# Altium project ECGAquisitionBoard.PrjPcb
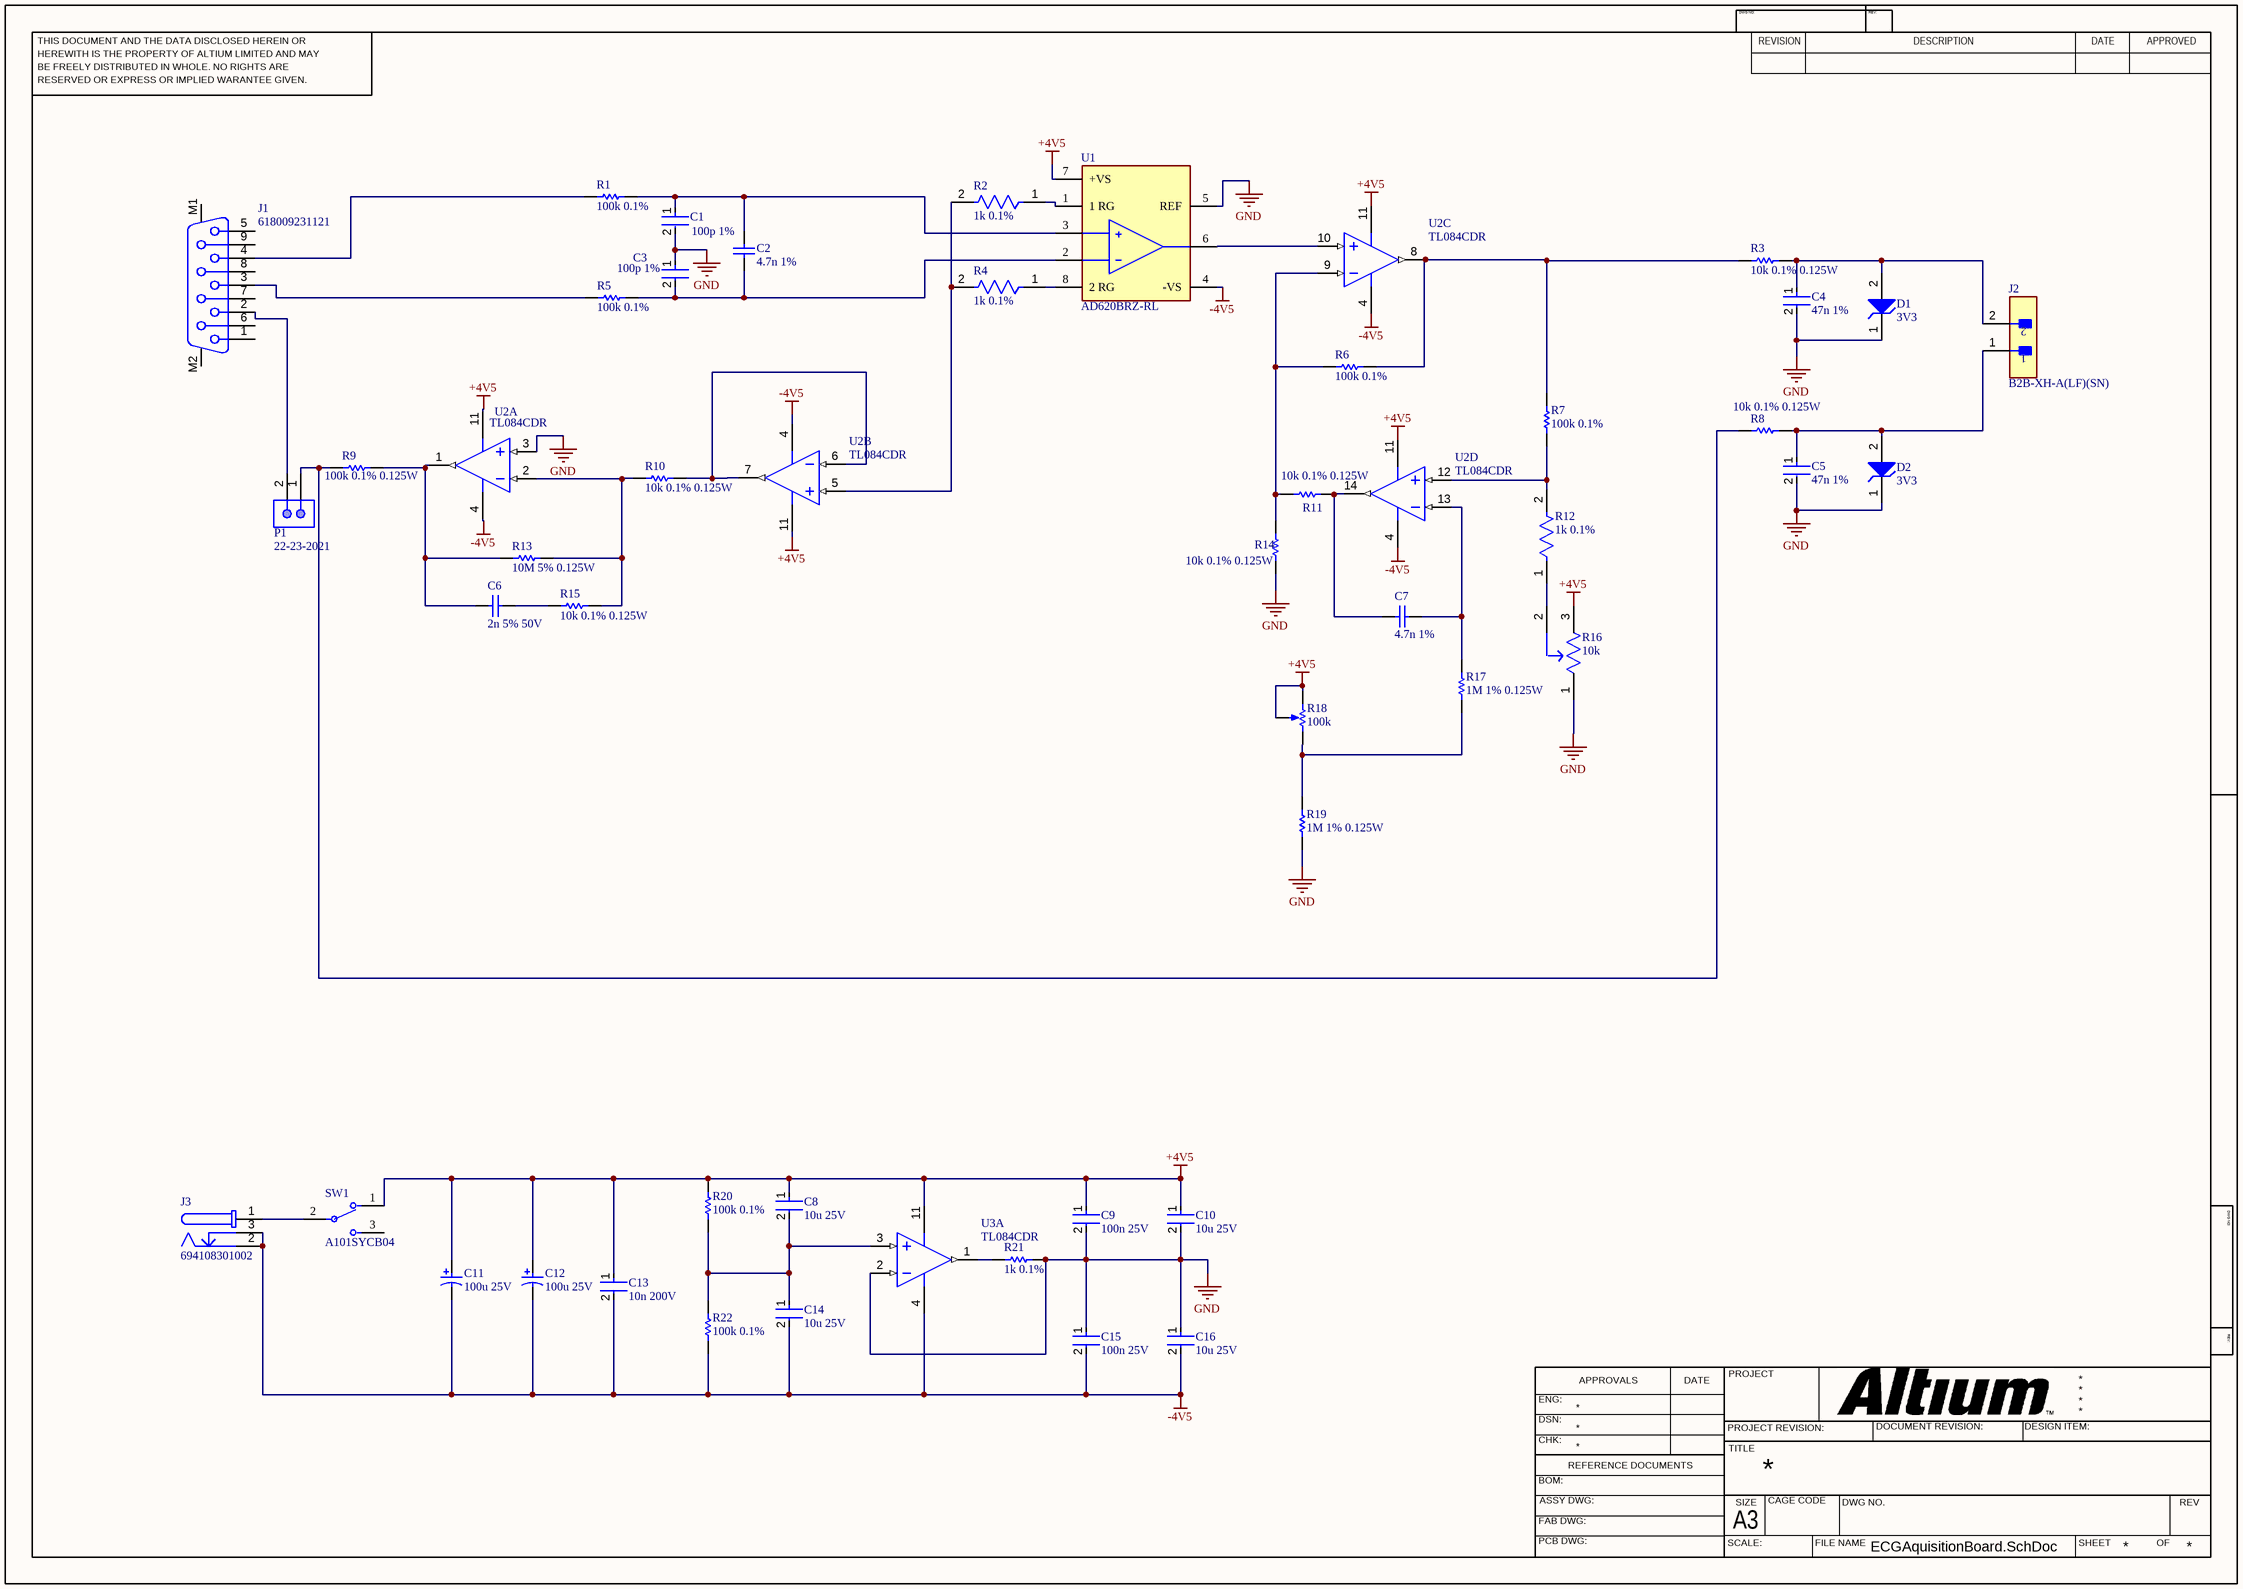
[diagram p0: ECGAquisitionBoard.SchDoc]
1 sheet, 48 parts. Net scope: global (net labels, ports and power ports of the same name join across sheets).
Board file: ECGAquisitionBoard.PcbDoc

## Sheet ECGAquisitionBoard.SchDoc
size 420 x 297 mm

### Parts
C1  100p 1%  [FP-0805-L_2_01_0_2-W_1_25-IPC_B]
C2  4.7n 1%  [CAPC2013X94X50ML20T25]
C3  100p 1%  [FP-0805-L_2_01_0_2-W_1_25-IPC_B]
C4  47n 1%  [FP-C1206C-EB-MFG]
C5  47n 1%  [FP-C1206C-EB-MFG]
C6  2n 5% 50V  [CAPC2013X70X45NL10T25]
C7  4.7n 1%  [CAPC2013X94X50ML20T25]
C8  10u 25V  [FP-GRM21B-0_15-IPC_C]
C9  100n 25V  [FP-C0805C-DN-MFG]
C10  10u 25V  [FP-GRM21B-0_15-IPC_C]
C11  100u 25V  [PNSC-FK-V-D8_V]
C12  100u 25V  [PNSC-FK-V-D8_V]
C13  10n 200V  [FP-0805-L_2_01_0_2-W_1_25-IPC_A]
C14  10u 25V  [FP-GRM21B-0_15-IPC_C]
C15  100n 25V  [FP-C0805C-DN-MFG]
C16  10u 25V  [FP-GRM21B-0_15-IPC_C]
D1  3V3  [ONSC-SOD-123-2-425-04_V]
D2  3V3  [ONSC-SOD-123-2-425-04_V]
J1  618009231121  [618009231121]
J2  B2B-XH-A(LF)(SN)  [FP-B2B-XH-A_LF_SN-MFG]
J3  694108301002  [694108301002]
P1  22-23-2021  [MOLX-22-23-2021_V]
R1  100k 0.1%  [RESC2013X60X40LL20T25_A]
R2  1k 0.1%  [FP-ERA6A-IPC_C]
R3  10k 0.1% 0.125W  [RESC2013X60X40LL20T25_A]
R4  1k 0.1%  [FP-ERA6A-IPC_C]
R5  100k 0.1%  [RESC2013X60X40LL20T25_A]
R6  100k 0.1%  [RESC2013X60X40LL20T25_A]
R7  100k 0.1%  [RESC2013X60X40LL20T25_A]
R8  10k 0.1% 0.125W  [RESC2013X60X40LL20T25_A]
R9  100k 0.1% 0.125W  [RESC2013X60X40LL20T25_A]
R10  10k 0.1% 0.125W  [RESC2013X60X40LL20T25_A]
R11  10k 0.1% 0.125W  [RESC2013X60X40LL20T25_A]
R12  1k 0.1%  [FP-ERA6A-IPC_C]
R13  10M 5% 0.125W  [RESC2013X50X30LL20T20]
R14  10k 0.1% 0.125W  [RESC2013X60X40LL20T25_A]
R15  10k 0.1% 0.125W  [RESC2013X60X40LL20T25_A]
R16  10k  [FP-3266W-MFG]
R17  1M 1% 0.125W  [RESC3216X70X50NL05T20]
R18  100k  [BOUR-3266W-3_V]
R19  1M 1% 0.125W  [RESC3216X70X50NL05T20]
R20  100k 0.1%  [RESC2013X60X40LL20T25_A]
R21  1k 0.1%  [RESC2013X60X40LL20T25_A]
R22  100k 0.1%  [RESC2013X60X40LL20T25_A]
SW1  A101SYCB04  [FP-A101SYCB04-MFG]
U1  AD620BRZ-RL  [FP-R-8-IPC_A]
U2  TL084CDR  [D0014A_N]  (parts A,B,C,D of 4)
U3  TL084CDR  [D0014A_N]  (part A of 4)

### Nets
+4V5: C8.1 C9.1 C10.1 C11.1 C12.1 C13.1 R16.3(CW) R18.1(CCW) R18.2(WIPER) R20.2 SW1.1 U1.7(+VS) U2.11(VCC-) U3.11(VCC-)
-4V5: C11.2 C12.2 C13.2 C14.2 C15.2 C16.2 J3.2 J3.3 R22.1 U1.4(-VS) U2.4(VCC+) U3.4(VCC+)
GND: C1.2 C3.1 C4.2 C5.2 C9.2 C10.2 C15.1 C16.1 D1.1(K) D2.1(K) R14.1 R16.1(CCW) R19.1 R21.1 U1.5(REF) U2.3(IN1+) U3.2(IN1-)
NetC1_1: C1.1 C2.2 R1.1 U1.3(+IN)
NetC2_1: C2.1 C3.2 R5.1 U1.2(-IN)
NetC4_1: C4.1 D1.2(A) J2.2 R3.1
NetC5_1: C5.1 D2.2(A) J2.1 R8.1
NetC6_1: C6.1 R9.1 R13.1 U2.1(OUT1)
NetC6_2: C6.2 R15.2
NetC7_1: C7.1 R17.2 U2.13(IN4-)
NetC7_2: C7.2 R11.1 U2.14(OUT4)
NetC8_2: C8.2 C14.1 R20.1 R22.2 U3.3(IN1+)
NetJ1_2: J1.2 P1.2
NetJ1_3: J1.3 R5.2
NetJ1_4: J1.4 R1.2
NetJ3_1: J3.1 SW1.2
NetP1_1: P1.1 R8.2 R9.2
NetR2_1: R2.1 U1.1(1_RG)
NetR2_2: R2.2 R4.2 U2.5(IN2+)
NetR3_2: R3.2 R6.1 R7.1 U2.8(OUT3)
NetR4_1: R4.1 U1.8(2_RG)
NetR6_2: R6.2 R11.2 R14.2 U2.9(IN3-)
NetR7_2: R7.2 R12.2 U2.12(IN4+)
NetR10_1: R10.1 U2.6(IN2-) U2.7(OUT2)
NetR10_2: R10.2 R13.2 R15.1 U2.2(IN1-)
NetR12_1: R12.1 R16.2(WIPER)
NetR17_1: R17.1 R18.3(CW) R19.2
NetR21_2: R21.2 U3.1(OUT1)
NetU1_6: U1.6(OUTPUT) U2.10(IN3+)

Not connected (* = marked no-connect by the designer): J1 1 5 6 7 8 9 M1 M2; SW1 3

### Notes on the sheet
- THIS DOCUMENT AND THE DATA DISCLOSED HEREIN OR
- HEREWITH IS THE PROPERTY OF ALTIUM LIMITED AND MAY
- DWG NO:
- REVISION
- REV:
- DESCRIPTION
- DATE
- APPROVED
- BE FREELY DISTRIBUTED IN WHOLE. NO RIGHTS ARE
- RESERVED OR EXPRESS OR IMPLIED WARANTEE GIVEN.
- ENG:
- APPROVALS
- PROJECT
- DSN:
- CHK:
- REFERENCE DOCUMENTS
- PROJECT REVISION:
- TITLE
- DOCUMENT REVISION:
- DESIGN ITEM:
- BOM:
- FAB DWG:
- PCB DWG:
- ASSY DWG:
- SCALE:
- A3
- SIZE
- CAGE CODE
- FILE NAME
- DWG NO.
- SHEET
- OF
- REV

### Library data of the parts
C1 C3 = CMP-2007-04119-2: General Purpose Ceramic Capacitor, 0805, 100pF, 1%, C0G, 30ppm/°C, 100V; Max Operating Temperature: 125°C; Lead Free: Lead Free; Tolerance: 1%; Case Code (Imperial): 0805; Dielectric: C0G; RoHS Compliant: Yes; Termination: SMD/SMT; Packaging: Tape and Reel; Depth: 1.25mm; Dielectric Material: Ceramic; REACH SVHC: No SVHC; Thickness: 0.037inch; Case Code (Metric): 2012; Series: -; Mount: Surface Mount; Min Operating Temperature: -55°C; Voltage: 100V; Capacitance: 100pF; Length: 2.01mm; Number of Pins: 2; Radiation Hardening: No; Voltage Rating: 100V; Voltage Rating (DC): 100V; Height: 0.71mm; Width: 1.25mm; Case/Package: 0805; Construction: Flat; Package Quantity: 1
C2 C7 = CMP-1036-03569-3: Part Number: 08053A472FAT2A; Manufacturer: AVX Interconnect / Elco
C4 C5 = CMP-1037-03977-2: CAP CER 0.047UF 50V NP0 1206; Manufacturer: KEMET; Manufacturer Part Number: C1206C473F5GACTU; Description: C1206 47,000 pF C0G 1.00% 50 V; Tolerance: 0.01; Automotive Grade: Grade 0; Value: 47,000 pF; Material: Ceramic; Temperature Coefficient: 15%; Temperature Characteristic: C0G; Device Class L1: Passive Components; Lead Free: Yes; Voltage Rating: 50 V; ComponentLink2URL: https://content.kemet.com/datasheets/KEM_C1007_X8R_ULTRA_150C_SMD.pdf; Device Class L2: Capacitors; Capacitance: 47,000 pF; Temperature Range High: +150°C; RoHS: TRUE; Temperature Range Low: -55°C; Category: Cap; Mouser Description: Multilayer Ceramic Capacitors MLCC - SMD/SMT 50volts 0.047uF 1% C0G; Height: 0.88mm; Device Class L3: Ceramic Capacitors; ComponentLink2Description: Datasheet; Octopart: https://octopart.com/c1206c473f5gactu-kemet-13140371; Digikey Description: CAP CER 0.047UF 50V NP0 1206; Package: C1206C-EB; Automotive: Yes; Temperature: -55°C to +150°C; Ipc Land Pattern Name: CAPC320160X78
C6 = CMP-2007-00880-1: Part Number: GRM2165C1H202JA01D; Manufacturer: Murata
C8 C10 C14 C16 = CMP-2007-03541-2: Chip Multilayer Ceramic Capacitors for General Purpose, 0805, 10uF, X5R, 15%, 10%, 25V; Length: 2mm; Depth: 1.25mm; Termination: SMD/SMT; Voltage: 25V; Height: 1.25mm; Material: Ceramic; Thickness: 0.053inch; Radiation Hardening: No; Min Operating Temperature: -55°C; Width: 0.049inch; Package Quantity: 1; Mount: Surface Mount; Dielectric: X5R; Packaging: Tape and Reel; Capacitance: 10uF; Voltage Rating (DC): 25V; Lead Free: Lead Free; Max Operating Temperature: 85°C; Case Code (Imperial): 0805; Case/Package: 0805; Tolerance: 10%; Voltage Rating: 25V; Case Code (Metric): 2012
C9 C15 = CMP-2007-00282-2: CAP CER 0.1UF 25V 20% X7R 0805; Manufacturer: KEMET; Manufacturer Part Number: C0805C104M3RACTU; Temperature Coefficient: 30ppm/°C; Capacitance: 0.10 μF; Description: C0805 0.10 μF X7R 30ppm/°C 20.00% 25 V; Material: Ceramic; Tolerance: 0.2; Value: 0.10 μF; Digikey Description: CAP CER 0.1UF 25V 20% X7R 0805; Device Class L2: Capacitors; Temperature: -55°C to +125°C; Device Class L1: Passive Components; ComponentLink2Description: Datasheet; Mouser Description: Multilayer Ceramic Capacitors MLCC - SMD/SMT 25volts 0.1uF X7R 20%; Temperature Range High: +125°C; Device Class L3: Ceramic Capacitors; Package: C0805C-DN; Automotive: No; Temperature Range Low: -55°C; RoHS: TRUE; Category: Cap; Lead Free: Yes; Ipc Land Pattern Name: CAPC200125X78; Voltage Rating: 25 V; Height: 0.88mm; Temperature Characteristic: X7R; Octopart: https://octopart.com/c0805c104m3ractu-kemet-9138612; ComponentLink2URL: https://content.kemet.com/datasheets/KEM_C1003_C0G_SMD.pdf
C11 C12 = CMP-2000-06206-1: Aluminum Electrolytic Capacitor, 100 uF, +/- 20%, 25 V, 2-Pin SMD (Size Code D8), -55 to 105 degC, RoHS, Tape and Reel; Manufacturer: Panasonic; Type: Can; Lifetime@Temperature: 2000Hrs@105°C; Capacitance: 100µF; Ripple Current: 280mA; Impedance: 0.34O; Case Size/Dimension: Ø6.3x7.7mm; Operating Temp-Max: 105°C; Series: FK; Package URL: http://industrial.panasonic.com/cdbs/www-data/pdf/RDE0000/DME0000COL48.pdf; Mounting Technology: SurfaceMount; Package Description: 2-Pin Electrolytic Aluminum Capacitor, Body 6.6 x 6.6 mm; Datasheet Version: 03/2016; Datasheet URL: http://industrial.panasonic.com/cdbs/www-data/pdf/RDE0000/ABA0000C1181.pdf; Manufacturer URL: http://www.panasonic.com/; Package Reference: FK-V-D8; Rated Voltage: 25V; Operating Temp Range: -55to+105°C
C13 = CMP-2007-04596-2: General Purpose Ceramic Capacitor, 0805, 10nF, 10%, X7R, 0.15, 200V; Dissipation Factor: 2.5%; Package Quantity: 1; Case/Package: 0805; Case Code (Metric): 2012; Voltage Rating: 200V; Voltage: 200V; Number of Pins: 2; Depth: 1.25mm; Length: 2.01mm; Dielectric: X7R; Lead Free: Lead Free; Mount: Surface Mount; REACH SVHC: No SVHC; Packaging: Tape and Reel; Termination: SMD/SMT; Radiation Hardening: No; Thickness: 0.037inch; Tolerance: 10%; Min Operating Temperature: -55°C; RoHS Compliant: Yes; Dielectric Material: Ceramic; Voltage Rating (DC): 200V; Contact Plating: Tin; Height: 0.94mm; Width: 0.049inch; Lead Pitch: 5.08mm; Case Code (Imperial): 0805; Capacitance: 10nF; Max Operating Temperature: 125°C
D1 D2 = CMP-1060-00363-1: Zener Voltage Regulator, 500 mW, 2-Pin SOD-123, Pb-Free, Tape and Reel; PartNumber: MMSZ5226BT1G; Manufacturer: On Semiconductor; P Max (W): 0.5; VZ Typ (V): 3.3; ComponentLink1Description: Manufacturer URL; ComponentLink3URL: http://www.onsemi.com/pub_link/Collateral/425-04.PDF; ComponentLink3Description: Package Specification; ComponentLink2Description: Datasheet; ComponentLink1URL: http://www.onsemi.com/; Mounting Technology: Surface Mount; Packing: Tape and Reel; PackageDescription: 2-Pin SOD, Body 1.6 x 2.69 mm; ComponentLink2URL: http://www.onsemi.com/pub_link/Collateral/MMSZ5221BT1-D.PDF; RoHS: Pb-Free; PackageVersion: Rev. G, 10/2009; PackageReference: SOD-123-2-425-04; DatasheetVersion: Rev. 12
J1 = CMP-1502-00200-2: NexarPartId: 18818187; Insulation Resistance: 5GΩ; Current Rating: 3A; Number of Contacts: 9; Contact Resistance: 30mΩ; Operating Supply Voltage: 125V; Gender: Female; Pitch: 2.77mm; Length: 30.8mm; Contact Material: Gold, Nickel; Insulation Material: PBT; RoHS: Compliant; Width: 12.5mm; Termination: SMD/SMT; Height: 12.7mm; Housing Material: Steel; Number of Pins: 9; Max Operating Temperature: 105°C; Mount: Through Hole; Contact Plating: Gold; Depth: 18.5mm; Min Operating Temperature: -55°C; REACH SVHC: Unknown; Number of Rows: 2; Orientation: Right Angle; Voltage Rating: 125V
J2 = CMP-2000-05888-3: CONN HEADER VERT 2POS 2.5MM; Current Rating: 3A; Voltage Rating: 250V; Number of Contacts: 2; Contact Resistance: 20mR; Wire/Cable Gauge: 22AWG; Insulation Resistance: 1GR; Connector Type: Male Pin; Packaging: Bulk; Contact Material: Brass; Lead Free: Lead Free; Orientation: Straight; Contact Plating: Tin; Max Current Rating: 3A; Termination: Solder; Fastening Type: Detent; Depth: 5.75mm; Housing Material: Polyamide; REACH SVHC: No SVHC; Series: XH; Voltage Rating (AC): 250V; Number of Positions: 2; Color: Natural; Contact Type: Male Pin; Max Voltage Rating (DC): 250V; Pitch: 2.5mm; Lead Pitch: 2.5mm; Mount: Through Hole; Max Operating Temperature: 85°C; Length: 7.4mm; Max Voltage Rating (AC): 250V; Min Operating Temperature: -25°C; Number of Rows: 1; Housing Color: White
J3 = CMP-1502-00190-3: NexarPartId: 52676102; Gender: Male; Voltage Rating: 24V; Insulation Resistance: 100MΩ; Voltage Rating (DC): 20V; Shielding: Unshielded; Connector Type: Power; Current Rating: 5A; Number of Contacts: 3; Packaging: Bulk; Operating Supply Voltage: 24V; Flammability Rating: UL94 V-0; Housing Material: Polyamide; Color: Black; REACH SVHC: Unknown; Contact Material: Gold, Tin; Max Operating Temperature: 85°C; Contact Gender: Female; Contact Plating: Tin; Termination: Through Hole; Min Operating Temperature: -40°C; RoHS: Compliant; Height: 11mm; Mount: Through Hole
P1 = CMP-1704-00001-3: Male Header, Pitch 2.54 mm, 1 x 2 Position, Height 10.67 mm, Tail Length 3.56 mm, 0 to 75 degC, RoHS, Bulk; Package Quantity: 3000; Height: 10.67 mm; RoHSCompliant: True; ComponentLink2URL: https://datasheet.ciiva.com/19454/232266-19454304.pdf; PartNumber: 22-23-2021; Packaging: Bulk; ComponentLink2Description: Datasheet; Min Operating Temperature: 0 degC; ComponentLink1Description: Manufacturer URL; Length: 5.08 mm; Mounting Technology: Through Hole; Max Operating Temperature: 75 degC; REACH SVHC: Unknown; PackageDescription: Male Header, Pitch 2.54 mm, 1 x 2 Position, Height 10.67 mm, Tail Length 3.56 mm; ComponentLink1URL: http://www.molex.com/; Mount: Through Hole; Radiation Hardening: No; Width: 6.35 mm; Pins: 2
R1 R3 R5-R11 R14 R15 R20-R22 = CMP-2001-00582-2: Metal Film Chip Resistor, High Reliability Type, 0.125 W, +/- 0.1%, -55 to 155 degC, 0805 (2012 Metric), RoHS, Tape and Reel; Voltage Rating: 100V; Power Rating: 125mW(1/8W); Brand: Panasonic; Temperature Coefficient: 25PPM/C; Resistance: 10kOhms; Product Category: ThinFilmResistors-SMD; Datasheet Version: 02/2016; Operating Temperature Range: -55Cto+155C; Length: 2mm; Mounting Technology: SurfaceMount; Manufacturer URL: http://www.panasonic.com/; Width: 1.25mm; Packaging: Reel; Product: ThinFilmResistorsSMD; Package / Case: 0805(2012metric); Termination Style: SMD/SMT; Tolerance: 0.1%; Datasheet URL: https://industrial.panasonic.com/cdbs/www-data/pdf/RDM0000/AOA0000C307.pdf; Package Description: 2-Pin Surface Mount Device, Body 2 x 1.25 mm; Factory Pack Quantity: 5000; Series: ERA-6A; Case Code - mm: 2012; RoHS: Details; Package Reference: 0805; Height: 0.5mm; Manufacturer: Panasonic; Case Code - in: 0805; Type: MetalFilmChipResistors
R2 R4 R12 = CMP-2001-00581-2: RES 1K OHM 0.1% 1/8W 0805; Temperature Coefficient: 25ppm/°C; Resistance: 1kR; Working Voltage: 100V; Max Power Dissipation: 125mW; Height: 0.5mm; Technology: THIN FILM; REACH SVHC: No SVHC; Packaging: Tape and Reel; Length: 2mm; Width: 1.25mm; Resistance Tolerance: 0.1%; Series: ERA-6A; Resistor Type: Thin Film; Number of Pins: 2; Case Code (Metric): 2012; Voltage Rating: 100V; Radiation Hardening: No; Construction: Rectangular; Mount: Surface Mount; Number of Terminations: 2; Case/Package: 0805; Min Operating Temperature: -55°C; Military Standard: Not; RoHS Compliant: Yes; Termination: SMD/SMT; Case Code (Imperial): 0805; Depth: 1.25mm; Power Rating: 125mW; Max Operating Temperature: 155°C; Contact Plating: Tin; Package Quantity: 5000; Tolerance: 0.1%
R13 = CMP-2001-04285-1: Part Number: CRCW080510M0JNEA; Manufacturer: Vishay Dale
R16 = CMP-07234-000016-1: TRIMMER 10K OHM 0.25W PC PIN TOP; Manufacturer: Bourns; Manufacturer Part Number: 3266W-1-103LF; Temperature Coefficient: 100ppm/°C; Tolerance: 10%; Value: 10kΩ; Standoff Height: 0.43mm; Device Class L3: Variable Resistors and Potentiometers; ComponentLink2URL: https://www.bourns.com/docs/Product-Datasheets/3266.pdf; ComponentLink2Description: Datasheet; Device Class L2: Resistors; Power Rating: 0.25W; Mouser Description: Trimmer Resistors - Through Hole 1/4 10Kohms 10% SQ W/Standoff Sealed; Category: Res; Digikey Description: TRIMMER 10K OHM 0.25W PC PIN TOP; Device Class L1: Passive Components; Octopart: https://octopart.com/3266w-1-103lf-bourns-81445; Height: 9.02mm; Temperature Range High: +125°C; Series: 3266; Temperature Range Low: -55°C; Composition: Cermet; Resistance: 10kΩ; Lead Free: Yes; RoHS: TRUE; Automotive: No; Package: 3266W; Temperature: -55°C to +125°C
R17 R19 = CMP-2003-00020-1: Part Number: ERJ-8ENF1004V; Manufacturer: Panasonic
R18 = CMP-0975-00021-1: Square Trimpot Trimming Potentiometer, 100 KOhm, 0.25 W, -55 to 125 degC, 3-Pin THD, RoHS, Tube; Manufacturer: Bourns; PartNumber: 3266W-1-104LF; Power Rating@70 degC: 0.25 W; Tolerance: +/-10%; ComponentLink2URL: https://www.bourns.com/data/global/pdfs/3266.pdf; ComponentLink3Description: Package Specification; ComponentLink1URL: https://www.bourns.com/; ComponentLink2Description: Datasheet; DatasheetVersion: Apr-14; ComponentLink3URL: https://www.bourns.com/data/global/pdfs/3266.pdf; Mounting Technology: Through Hole; Packing: Tube; PackageDescription: 3-Pin THD, Body 6.35 x 4.31 mm, Pitch 2.54 mm; ComponentLink1Description: Manufacturer URL; Operating Temperature: -55 to 125 degC; Resistance: 100 kOhm; RoHS: TRUE
SW1 = CMP-03408-000017-1: SWITCH TOGGLE SPDT 0.4VA 20V; Electrical Life: 6000Cycles; Number of Poles: 1; Power Rating: 400mW; Switch Function: On-On; Contact Resistance: 10mR; Contact Current Rating: 400mA; Actuator Material: Phenolic; Insulation Resistance: 30MR; Actuator Color: Chrome; Number of Positions: 2; Actuator Type: Standard Round; Actuator Length: 10.41mm; Illumination Type: Non-Illuminated; Flammability Rating: UL94 V-1; Contact Material: Copper; Depth: 6.86mm; Contact Plating: Gold; Voltage Rating (AC): 20V; Max Voltage Rating (DC): 20V; Min Operating Temperature: -30°C; Max Operating Temperature: 85°C; Throw Configuration: SPDT; Packaging: Bulk; Termination: PC Pins; Series: Gemini A; ELV: Compliant; Lead Free: Lead Free; RoHS Compliant: Yes; REACH SVHC: No SVHC; Mount: Panel; Orientation: Straight; Package Quantity: 100; Max Voltage Rating (AC): 20V; Radiation Hardening: No; Voltage Rating (DC): 20V
U1 = CMP-09116-000146-1: IC INST AMP 1 CIRCUIT 8SOIC; Number of Circuits: 1; Power Dissipation: 650mW; Amplifier Type: INSTRUMENTATION AMPLIFIER; Input Resistance: 10GR; -3db Bandwidth: 1MHz; Min Supply Voltage: 4.6V; Operating Supply Current: 1.3mA; Slew Rate: 1.2V/µs; Min Dual Supply Voltage: 2.3V; Input Offset Voltage (Vos): 30mV; Common Mode Rejection Ratio: 93dB; Output Current per Channel: 18mA; Operating Supply Voltage: 18V; Input Bias Current: 1nA; Mount: Surface Mount; Min Operating Temperature: -55°C; Series: -; RoHS Compliant: Yes; Lead Free: Contains Lead; Nominal Supply Current: 1.3mA; Number of Elements: 1; Packaging: Tape and Reel; Package Quantity: 2500; Number of Pins: 8; Max Operating Temperature: 125°C; Number of Channels: 1; Case/Package: SOIC; Contact Plating: Tin; Radiation Hardening: No; Max Power Dissipation: 650mW; Max Dual Supply Voltage: 18V
U2 U3 = CMP-0017-00129-2: JFET-Input Operational Amplifier, 7 to 36 V, 0 to 70 degC, 14-pin SOIC (D14), Green (RoHS & no Sb/Br); Manufacturer: Texas Instruments; Sub Family: General Purpose Amplifier, High Supply Voltage Amplifier (>=30V); CMRR(Min)(dB): 70; Vio (25C)(Max)(mV): 15; Number of Channels: 4; Slew Rate(Typ)(V/us): 13; Iq per channel(Max)(mA): 2.8; Rating: Catalog; IIB(Max)(pA): 400; Total Supply Voltage(Min)(+5V is 5, +/-5V is 10): 7; Vn at 1kHz(Typ)(nV/rtHz): 18; Total Supply Voltage(Max)(+5V is 5, +/-5V is 10): 36; GBW(Typ)(MHz): 3; PartNumber: TL084CDR; ComponentLink2Description: Datasheet; Eco-Plan: Green (RoHS & no Sb/Br); ComponentLink1Description: Manufacturer URL; PackageVersion: 4040047-5/M, 06/2011; ComponentLink2URL: http://www.ti.com/lit/ds/symlink/tl084.pdf; Mounting Technology: Surface Mount; ComponentLink3Description: Package Specification; ComponentLink3URL: http://www.ti.com/lit/ml/mpds177g/mpds177g.pdf; DatasheetVersion: SLOS081G; PackageDescription: 14-Pin Plastic Small Outline, Body 8.65 x 3.90 mm, Pitch 1.27 mm; PackageReference: D0014A; Offset Drift(Typ)(uV/C): 18; Code_JEDEC: MS-012; ComponentLink1URL: http://www.ti.com/